# Altium schematic sheet Rajesh_Jasti_17978253_Lab_1.SchDoc
size A; DrawnBy: Rajesh Jasti; Revision: Prototype; SheetNumber: 1; SheetTotal: 1
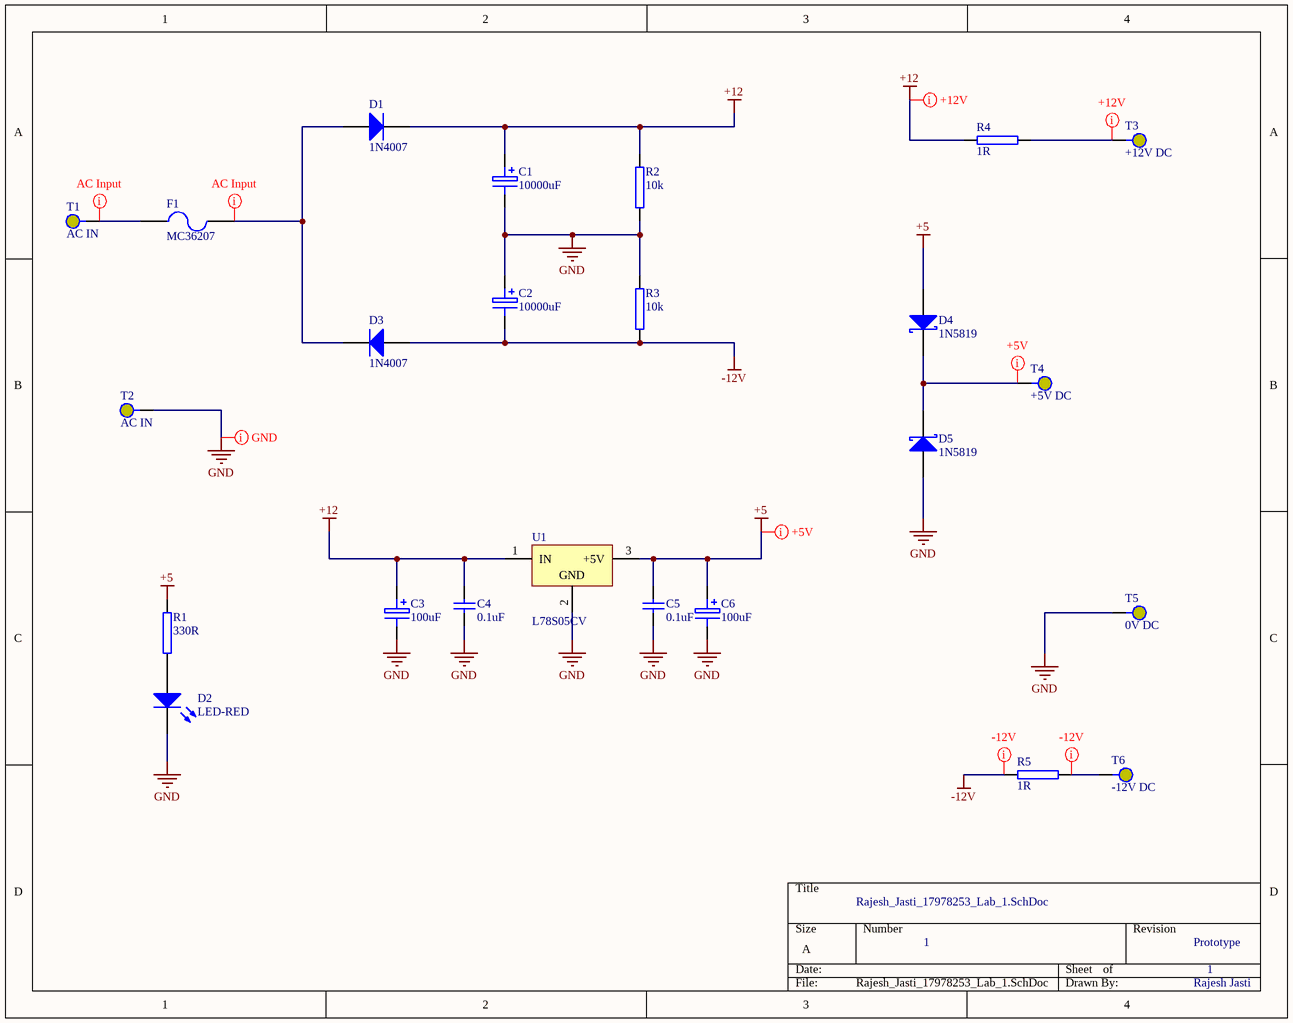
[diagram p0: Rajesh_Jasti_17978253_Lab_1.SchDoc]

## Parts
C1  10000uF  [CAPP18-7.5mm]
C2  10000uF  [CAPP18-7.5mm]
C3  100uF  [CAPP150-300_AUT]
C4  0.1uF  [RAD-0.1_AUT]
C5  0.1uF  [RAD-0.1_AUT]
C6  100uF  [CAPP150-300_AUT]
D1  1N4007  [DIODE0.4_AUT]
D2  LED-RED  [LED3MM_R_AUT]
D3  1N4007  [DIODE0.4_AUT]
D4  1N5819  [DIODE0.4_AUT]
D5  1N5819  [DIODE0.4_AUT]
F1  MC36207  [MC36207]
R1  330R  [AXIAL-0.4AUT]
R2  10k  [AXIAL-0.4AUT]
R3  10k  [AXIAL-0.4AUT]
R4  1R  [AXIAL-0.5AUT]
R5  1R  [AXIAL-0.5AUT]
T1  AC IN  [PAD3_AUT]
T2  AC IN  [PAD3_AUT]
T3  +12V DC  [PAD3_AUT]
T4  +5V DC  [PAD3_AUT]
T5  0V DC  [PAD3_AUT]
T6  -12V DC  [PAD3_AUT]
U1  L78S05CV  [TO-220H]

## Nets
+5: C5.2 C6.1 D4.A R1.2 U1.3(+5V)
+12: C1.1 C3.1 C4.2 D1.K R2.2 R4.1 U1.1(IN)
-12V: C2.2 D3.A R3.1 R5.1
GND: C1.2 C2.1 C3.2 C4.1 C5.1 C6.2 D2.K D5.A R2.1 R3.2 T2.1 T5.1 U1.2(GND)
NetD1_A: D1.A D3.K F1.2
NetD2_A: D2.A R1.1
NetD4_K: D4.K D5.K T4.1
NetF1_1: F1.1 T1.1
NetR4_2: R4.2 T3.1
NetR5_2: R5.2 T6.1

## Layout directives
rule Width Constraint [Pref Width = 80mil    Min Width = 60mil    Max Width = 100mil]: GND, NetD1_A, NetF1_1
rule Width Constraint [Pref Width = 60mil    Min Width = 40mil    Max Width = 70mil]: +12, -12V, NetR4_2, NetR5_2
rule Width Constraint [Pref Width = 50mil    Min Width = 30mil    Max Width = 70mil]: +5, NetD4_K

## Library data of the parts
C1 C2 = CAPACITOR 10000uF: Polarized Aluminum Capacitor, Through Hole, Pitch 7.5mml, Body 18mm(Dia); Supplier 1: Farnell; Supplier Part Number 1: 1899587
C3 C6 = CAPP150-300: Polarized Aluminum Capacitor, Through Hole, Pitch 150mil, Body 300mil (Dia)
C4 C5 = CAPN RAD0.1: Non Polarized Capacitor, Multilayer Ceramic Dipped Radial, Pitch 100mil
D1 D3 = 1N4007: Diode, Standard, 1A, 1000v; Supplier 1: Farnell; Supplier Part Number 1: 9549129
D2 = 3mm LED-RED: 3mm RED LED, Through Hole; Supplier 1: Farnell; Supplier Part Number 1: 1003207
D4 D5 = 1N5819: Schottky Diode, 1A,40v; Supplier 1: Farnell; Supplier Part Number 1: 1017589
F1 = MC36207: Fuse, PTC Reset, 200mA Hold, 400mA Tripping, 30v; Supplier 1: Farnell; Supplier Part Number 1: 2366765
R1-R3 = Resistor 1/4W: Resistor, Through Hole, Pitch 400mil
R4 R5 = Resistor 1/2W: Resistor, Through Hole, Pitch 500mil
T1-T6 = Terminal3: Terminal, Pad 200x250mil, Hole 62mil
U1 = L78S05CV: 5V, 2A, LDO, TO-220-3; Supplier 1: Farnell; Supplier Part Number 1: 9756086